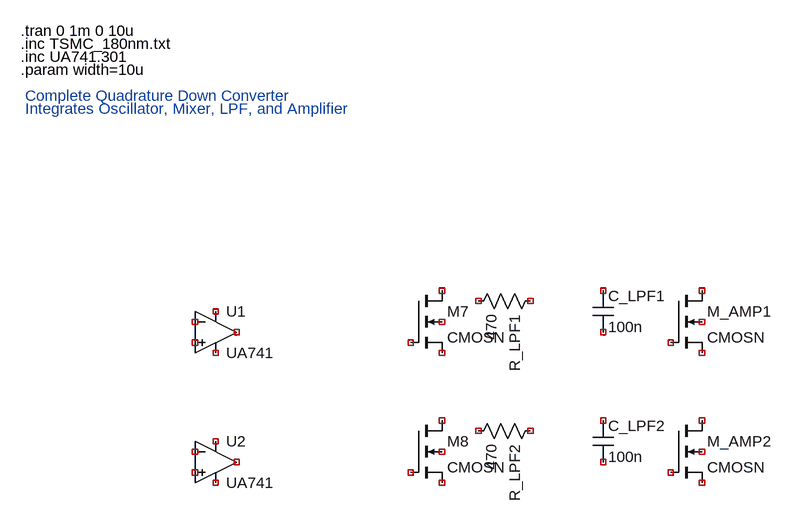
[diagram p0: schematic qdc_complete.asc]
qdc_complete.asc, the LTspice schematic file:
Version 4
SHEET 1 1200 800
TEXT -200 -200 Left 2 !.tran 0 1m 0 10u
TEXT -200 -180 Left 2 !.inc TSMC_180nm.txt
TEXT -200 -160 Left 2 !.inc UA741.301
TEXT -200 -140 Left 2 !.param width=10u
TEXT -200 -100 Left 2 ; Complete Quadrature Down Converter
TEXT -200 -80 Left 2 ; Integrates Oscillator, Mixer, LPF, and Amplifier
SYMBOL nmos4 400 200 R0
SYMATTR InstName M7
SYMATTR Value CMOSN
SYMBOL nmos4 400 400 R0
SYMATTR InstName M8
SYMATTR Value CMOSN
SYMBOL OpAmps\\opamp2 100 200 R0
SYMATTR InstName U1
SYMATTR Value UA741
SYMBOL OpAmps\\opamp2 100 400 R0
SYMATTR InstName U2
SYMATTR Value UA741
SYMBOL res 600 200 R90
SYMATTR InstName R_LPF1
SYMATTR Value 470
SYMBOL cap 680 200 R0
SYMATTR InstName C_LPF1
SYMATTR Value 100n
SYMBOL res 600 400 R90
SYMATTR InstName R_LPF2
SYMATTR Value 470
SYMBOL cap 680 400 R0
SYMATTR InstName C_LPF2
SYMATTR Value 100n
SYMBOL nmos4 800 200 R0
SYMATTR InstName M_AMP1
SYMATTR Value CMOSN
SYMBOL nmos4 800 400 R0
SYMATTR InstName M_AMP2
SYMATTR Value CMOSN

The netlist it stands for:
* qdc_complete.asc
M7 NC_01 NC_02 NC_03 NC_04 CMOSN
M8 NC_05 NC_06 NC_07 NC_08 CMOSN
XU1 NC_09 NC_10 NC_11 NC_12 NC_13 UA741  ; pins In+ In- V+ V- OUT
XU2 NC_14 NC_15 NC_16 NC_17 NC_18 UA741  ; pins In+ In- V+ V- OUT
R_LPF1 NC_19 NC_20 470
C_LPF1 NC_21 NC_22 100n
R_LPF2 NC_23 NC_24 470
C_LPF2 NC_25 NC_26 100n
M_AMP1 NC_27 NC_28 NC_29 NC_30 CMOSN
M_AMP2 NC_31 NC_32 NC_33 NC_34 CMOSN
.model NMOS NMOS
.model PMOS PMOS
.lib standard.mos
.tran 0 1m 0 10u
.inc TSMC_180nm.txt
.inc UA741.301
.param width=10u
*  Complete Quadrature Down Converter
*  Integrates Oscillator, Mixer, LPF, and Amplifier
.backanno
.end